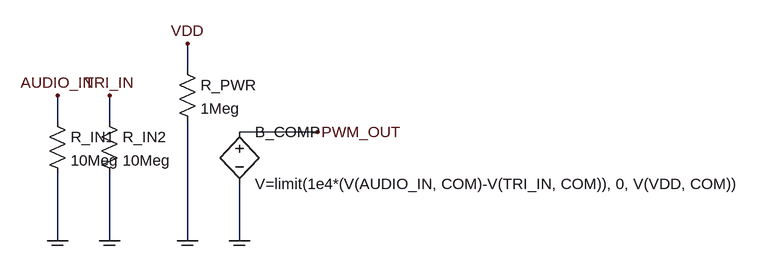
[diagram p0: schematic pwm_modulator.asc]
pwm_modulator.asc, the LTspice schematic file:
Version 4
SHEET 1 1200 800
FLAG 160 160 AUDIO_IN
FLAG 240 160 TRI_IN
FLAG 360 80 VDD
FLAG 160 384 COM
FLAG 240 384 COM
FLAG 360 384 COM
FLAG 560 216 PWM_OUT
SYMBOL res 144 184 R0
SYMATTR InstName R_IN1
SYMATTR Value 10Meg
WIRE 160 160 160 200
WIRE 160 280 160 384
SYMBOL res 224 184 R0
SYMATTR InstName R_IN2
SYMATTR Value 10Meg
WIRE 240 160 240 200
WIRE 240 280 240 384
SYMBOL res 344 104 R0
SYMATTR InstName R_PWR
SYMATTR Value 1Meg
WIRE 360 80 360 120
WIRE 360 200 360 384
SYMBOL bv 440 200 R0
SYMATTR InstName B_COMP
SYMATTR Value V=limit(1e4*(V(AUDIO_IN, COM)-V(TRI_IN, COM)), 0, V(VDD, COM))
WIRE 440 216 560 216
WIRE 440 296 440 384
FLAG 440 384 COM

The netlist it stands for:
* pwm_modulator.asc
R_IN1 AUDIO_IN COM 10Meg
R_IN2 TRI_IN COM 10Meg
R_PWR VDD COM 1Meg
B_COMP PWM_OUT COM V=limit(1e4*(V(AUDIO_IN, COM)-V(TRI_IN, COM)), 0, V(VDD, COM))
.backanno
.end